# EAGLE design EMG_EEG_PreAmp_Alpha1b (EAGLE 9.2.0)
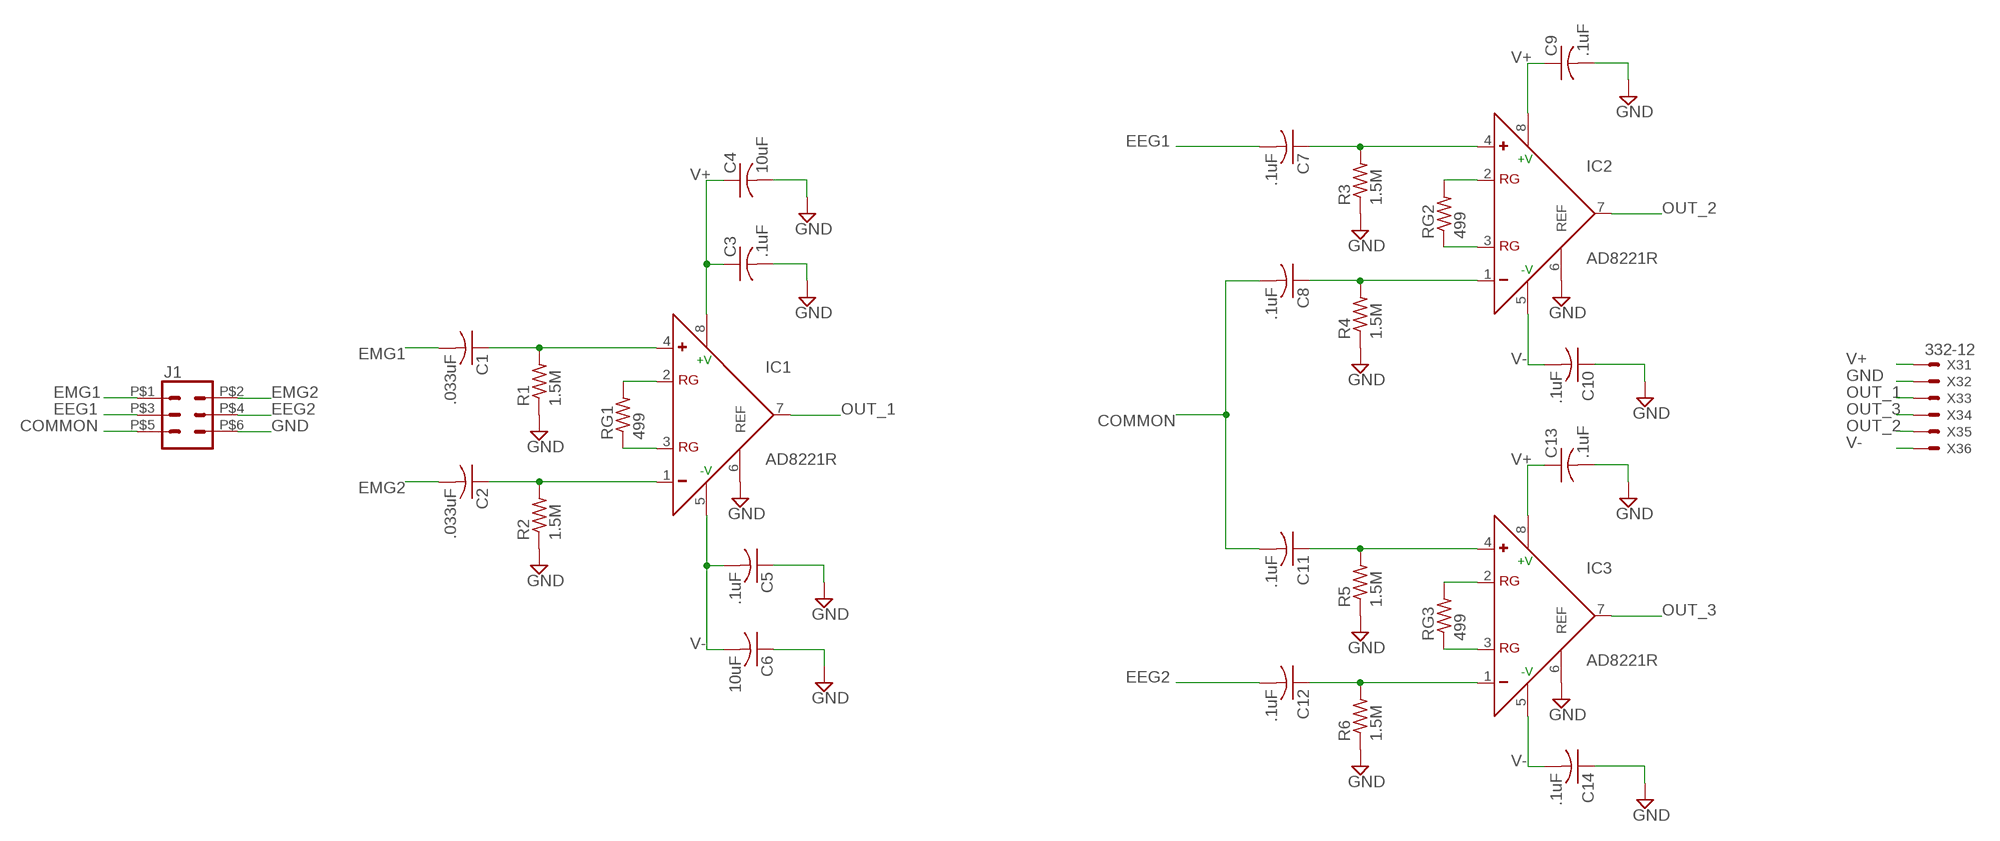
[diagram p0: schematic, sheet 1]

## Parts
C1  .033uF  C-USC0805K  [C0805K]
C2  .033uF  C-USC0805K  [C0805K]
C3  .1uF  C-USC0805K  [C0805K]
C4  10uF  C-USC0805K  [C0805K]
C5  .1uF  C-USC0805K  [C0805K]
C6  10uF  C-USC0805K  [C0805K]
C7  .1uF  C-USC0805K  [C0805K]
C8  .1uF  C-USC0805K  [C0805K]
C9  .1uF  C-USC0805K  [C0805K]
C10  .1uF  C-USC0805K  [C0805K]
C11  .1uF  C-USC0805K  [C0805K]
C12  .1uF  C-USC0805K  [C0805K]
C13  .1uF  C-USC0805K  [C0805K]
C14  .1uF  C-USC0805K  [C0805K]
IC1  AD8221R  [SO8]
IC2  AD8221R  [SO8]
IC3  AD8221R  [SO8]
J1  2X3MILL-MAX  [2X3_MILL-MAX_853]
R1  1.5M  R-US_R0805  [R0805]
R2  1.5M  R-US_R0805  [R0805]
R3  1.5M  R-US_R0805  [R0805]
R4  1.5M  R-US_R0805  [R0805]
R5  1.5M  R-US_R0805  [R0805]
R6  1.5M  R-US_R0805  [R0805]
RG1  499  R-US_R0805  [R0805]
RG2  499  R-US_R0805  [R0805]
RG3  499  R-US_R0805  [R0805]
X3  332-12  [1X6_WITH_STRAIN_RELIEF]

## Nets
COMMON: C8.2 C11.2 J1.P$5
EEG1: C7.2 J1.P$3
EEG2: C12.2 J1.P$4
EMG1: C1.2 J1.P$1
EMG2: C2.2 J1.P$2
GND: C3.2 C4.2 C5.1 C6.1 C9.2 C10.1 C13.2 C14.1 IC1.6(REF) IC2.6(REF) IC3.6(REF) J1.P$6 R1.1 R2.1 R3.1 R4.1 R5.1 R6.1 X3.2
N$1: IC1.3(RG) RG1.1
N$2: IC1.2(RG) RG1.2
N$3: C2.1 IC1.1(-) R2.2
N$4: C1.1 IC1.4(+) R1.2
N$7: IC2.3(RG) RG2.1
N$8: IC2.2(RG) RG2.2
N$9: C8.1 IC2.1(-) R4.2
N$10: C7.1 IC2.4(+) R3.2
N$13: IC3.3(RG) RG3.1
N$14: IC3.2(RG) RG3.2
N$15: C12.1 IC3.1(-) R6.2
N$16: C11.1 IC3.4(+) R5.2
OUT_1: IC1.7(OUT) X3.3
OUT_2: IC2.7(OUT) X3.5
OUT_3: IC3.7(OUT) X3.4
V+: C3.1 C4.1 C9.1 C13.1 IC1.8(+V) IC2.8(+V) IC3.8(+V) X3.1
V-: C5.2 C6.2 C10.2 C14.2 IC1.5(-V) IC2.5(-V) IC3.5(-V) X3.6

## Library data of the parts
C1-C14 = resistor:C-US: CAPACITOR, American symbol
IC1-IC3 = Pavel_ICs:AD8221: Low Cost, Low Power, Instrumentation Amplifier Source: http://www.analog.com/UploadedFiles/Data_Sheets/37793330023930AD620_e.pdf; MPN: AD620AR; OC_FARNELL: 1464424; OC_NEWARK: 05F7109
J1 = Pavel_Connectors:2X3: Multi connection point. Often used as Generic Header-pin footprint for 0.1 inch spaced/style header connections You can populate with any combo of single row headers, but if you'd like an exact match, check these: Header - 2x3 (Male, 0.1") <https://www.sparkfun.com/products/12807> (PRT-12807) Header - 2x3 (Female, 0.1") <https://www.sparkfun.com/products/13010> (PRT-13010) 2x3 Pin Shrouded Header <https://www.sparkfun.com/products/10877> (PRT-10877) On any of the 0.1 inch spaced packages, you can populate with these: Break Away Headers - Straight <https://www.sparkfun.com/products/116> (PRT-00116) Break Away Male Headers - Right Angle <https://www.sparkfun.com/products/553> (PRT-00553) Female Headers <https://www.sparkfun.com/products/115> (PRT-00115) Break Away Headers - Machine Pin <https://www.sparkfun.com/products/117> (PRT-00117) Break Away Female Headers - Swiss Machine Pin <https://www.sparkfun.com/products/743> (PRT-00743) Special note: the shrouded connector mates well with our 3x2 ribbon cables: Ribbon Crimp Connector - 6-pin (2x3, Female) <https://www.sparkfun.com/products/10651> (PRT-10651) Ribbon Cable - 6 wire (15ft) <https://www.sparkfun.com/products/10646> (PRT-10646); PROD_ID: HW-11044
R1-R6 RG1-RG3 = resistor:R-US_: RESISTOR, American symbol
X3 = Pavel_Connectors:332-12: 12 Pin - 2mm Dual Row Source: www.mpe-connector.de / garry_shortform_2012.pdf

## Board
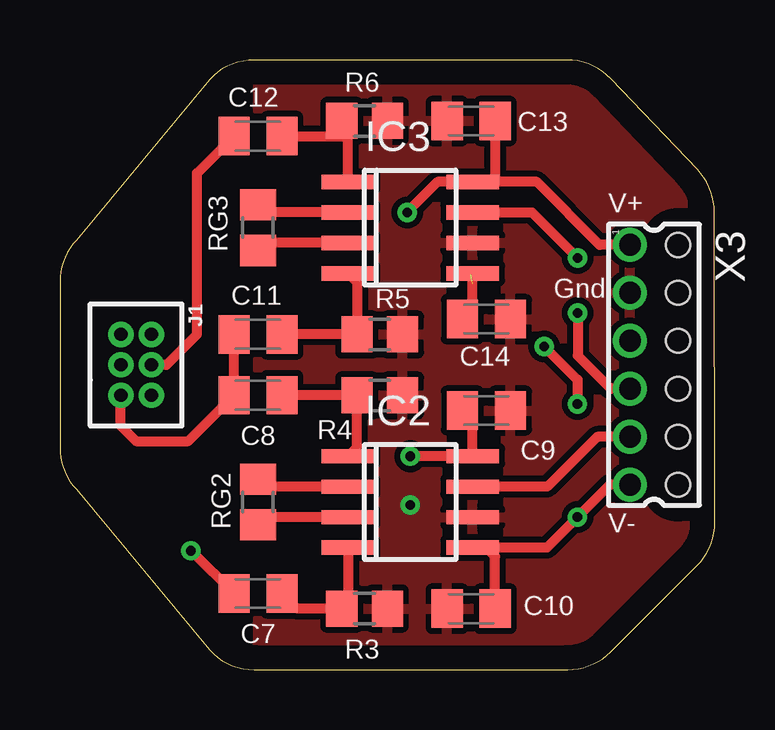
[diagram p1: board, top side]
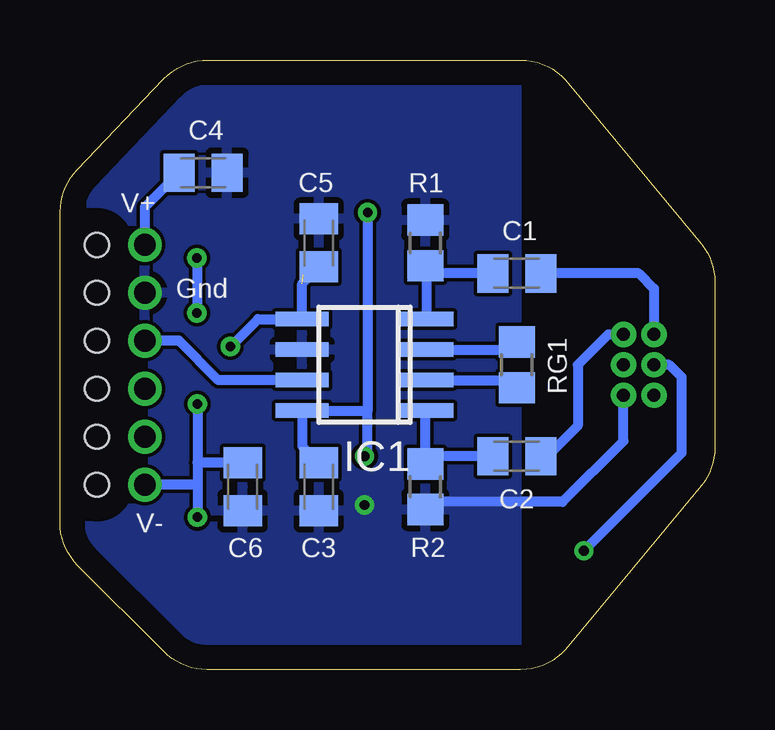
[diagram p2: board, bottom side, seen from below]

Size 27.3 x 25.4 mm. Coordinates in mm from the lower left corner, seen from the top.
Outline: 0.67,7.53 6.23,0.82 arc47 8.1,0 21.17,0 arc45 22.97,0.74 26.56,4.33 arc45 27.3,6.13 27.29,19.07 arc44 26.59,20.82 22.98,24.61 arc46 21.14,25.4 8.1,25.4 arc47 6.23,24.58 0.67,17.88 arc43 0,16.15 0,9.25 arc43 0.67,7.53
Copper layers (1*16): Top 0.035mm / dielectric 1.5mm / Bottom 0.035mm
Design rules "default *": minimum track width 6mil, minimum drill 0.35mm, track to track 6mil, track to pad 6mil, pad to pad 6mil, via to via 6mil, smd to smd 6mil, copper to edge 40mil, drill to drill 6mil, minimum pad ring 10mil, minimum via ring 8mil, stop-mask expansion 4mil, vias tented up to drill 0mil, thermal gap 10mil

### Footprints (pad centres in the part's own frame; a part is rotated, then mirrored left to right if it is on the bottom)
C0805K = smd 1.3 x 1.6: 1 -1,0; 2 1,0
SO8 = smd 0.6 x 2.2: 1 -1.905,-2.6; 2 -0.635,-2.6; 3 0.635,-2.6; 4 1.905,-2.6; 5 1.905,2.6; 6 0.635,2.6; 7 -0.635,2.6; 8 -1.905,2.6
2X3_MILL-MAX_853 = drill 0.55 pad 0.813: P$1 -1.27,-0.635; P$2 -1.27,0.635; P$3 0,-0.635; P$4 0,0.635; P$5 1.27,-0.635; P$6 1.27,0.635
R0805 = smd 1.3 x 1.5: 1 -0.95,0; 2 0.95,0
1X6_WITH_STRAIN_RELIEF = drill 0.9 pad 1.27: 1 -5,-1; 2 -3,-1; 3 -1,-1; 4 1,-1; 5 3,-1; 6 5,-1 | hole 1: -1,1; -3,1; -5,1; 1,1; 3,1; 5,1

### Placement (x,y rotation side)
C1  8.26,16.51 0 bottom
C2  8.26,8.89 0 bottom
C3  16.51,7.62 270 bottom
C4  21.34,20.7 0 bottom
C5  16.51,17.78 270 bottom
C6  19.68,7.62 90 bottom
C7  8.26,3.17 180 top
C8  8.26,11.43 180 top
C9  17.78,10.79 0 top
C10  17.14,2.54 0 top
C11  8.26,13.97 180 top
C12  8.26,22.23 180 top
C13  17.14,22.86 180 top
C14  17.78,14.61 180 top
IC1  14.61,12.7 90 bottom
IC2  14.61,6.99 270 top
IC3  14.61,18.41 270 top
J1  3.17,12.7 270 top
R1  12.06,17.78 270 bottom
R2  12.06,7.62 90 bottom
R3  12.7,2.54 180 top
R4  13.34,11.43 180 top
R5  13.34,13.97 180 top
R6  12.7,22.86 180 top
RG1  8.26,12.7 270 bottom
RG2  8.26,6.99 90 top
RG3  8.26,18.41 90 top
X3  24.77,12.7 270 top

### Tracks (layer width: path | path; a pad name or v marks a point on that pad's centre or on a via)
COMMON
  Top 0.406: C11.2 C8.2 5.35,9.53 3.17,9.53 2.54,10.16 J1.P$5
EEG1  (via drill 0.4)
  Top 0.406: v5.46,4.95 5.48,4.95 C7.2
  Bottom 0.406: v5.46,4.95 1.4,9.02 1.4,12.19 1.91,12.7 J1.P$3
EEG2
  Top 0.406: C12.2 5.71,20.68 5.71,13.97 4.45,12.7 J1.P$4
EMG1
  Bottom 0.406: C1.2 3.17,16.51 2.54,15.88 J1.P$1
EMG2
  Bottom 0.406: C2.2 6.99,8.89 5.71,10.16 5.71,12.7 4.45,13.97 J1.P$2
GND  (via drill 0.4)
  Bottom 0.406: R2.1 11.75,6.99 6.35,6.99 3.81,9.53 J1.P$6
  other vias: 14.61,6.86
  pour Top (isolate 0.254): 8.26,27.3 28.57,27.3 28.57,-2.54 8.26,-2.54
  pour Bottom: 8.26,27.3 29.21,27.3 29.21,-1.27 8.26,-1.27
N$1
  Bottom 0.406: IC1.3 8.57,13.34 RG1.1
N$2
  Bottom 0.406: IC1.2 8.57,12.06 RG1.2
N$3
  Bottom 0.406: IC1.1 12.06,10.73 R2.2 11.74,8.89 C2.1
N$4
  Bottom 0.406: IC1.4 12.01,16.51 | 12.01,16.51 12.01,16.77 R1.2 | C1.1 12.01,16.51
N$7
  Top 0.406: IC2.3 8.57,6.35 RG2.1
N$8
  Top 0.406: IC2.2 8.57,7.62 RG2.2
N$9
  Top 0.406: C8.1 R4.2 12.38,9.27 IC2.1
N$10
  Top 0.406: IC2.4 12.01,3.17 12.01,2.54 R3.2 9.89,2.54 C7.1
N$13
  Top 0.406: IC3.3 8.57,17.78 RG3.1
N$14
  Top 0.406: IC3.2 8.57,19.05 RG3.2
N$15
  Top 0.406: IC3.1 12.01,22.23 | 12.01,22.23 12.01,22.86 R6.2 | C12.1 12.01,22.23
N$16
  Top 0.406: C11.1 R5.2 12.38,16.13 IC3.4
OUT_1
  Bottom 0.406: X3.3 22.37,13.7 22.35,13.72 20.7,12.06 IC1.7
OUT_2
  Top 0.406: IC2.7 20.32,7.62 22.4,9.7 X3.5
OUT_3  (via drill 0.4)
  Top 0.406: IC3.7 19.68,19.05 v21.59,17.14 | v21.59,14.86 21.59,13.08 22.97,11.7 X3.4
  Bottom 0.406: v21.59,17.14 v21.59,14.86
V+  (via drill 0.4)
  Top 0.406: C9.1 17.2,10.37 IC2.8 v14.61,8.89 | v14.48,19.05 15.75,20.32 IC3.8 18.16,20.32 | 18.16,20.32 19.88,20.32 22.5,17.7 X3.1 | 18.16,20.32 18.14,20.34 C13.1
  Bottom 0.406: C3.1 17.2,9.31 IC1.8 14.61,10.79 14.48,10.79 | C4.1 23.77,19.27 X3.1 | v14.48,19.05 14.48,10.79 | v14.61,8.89 14.48,9.02 14.48,10.79
V-  (via drill 0.4)  (1 unrouted)
  Top 0.406: C10.2 18.14,4.71 17.78,5.08 IC2.5 20.3,5.08 v21.57,6.35 22.92,7.7 X3.6 | v21.57,11.06 21.57,12.08 v20.19,13.46 | 17.14,16.45 IC3.5 17.2,15.03 C14.2
  Bottom 0.406: 21.57,7.7 X3.6 | v20.19,13.46 19.05,14.61 IC1.5 17.2,16.09 C5.2 16.51,16.57 | v21.57,11.06 21.57,8.64 | 21.57,8.64 21.57,7.7 | 21.57,7.7 v21.57,6.35 | C6.2 21.56,8.62 21.57,8.64

### Text on the board
tNames: V+ | Gnd | V-
bNames: V+ | Gnd | V-